# Altium schematic sheet JETSON AGX CSI-I2C-I2S.SchDoc: Jetson AGX CSI-I2C-I2S
size 431 x 279 mm; CheckedBy: Lance Bantoto; Engineer: Cindy Li, Chealsie Bains; DocumentNumber: 8; Revision: 1; SheetNumber: 8; SheetTotal: 23
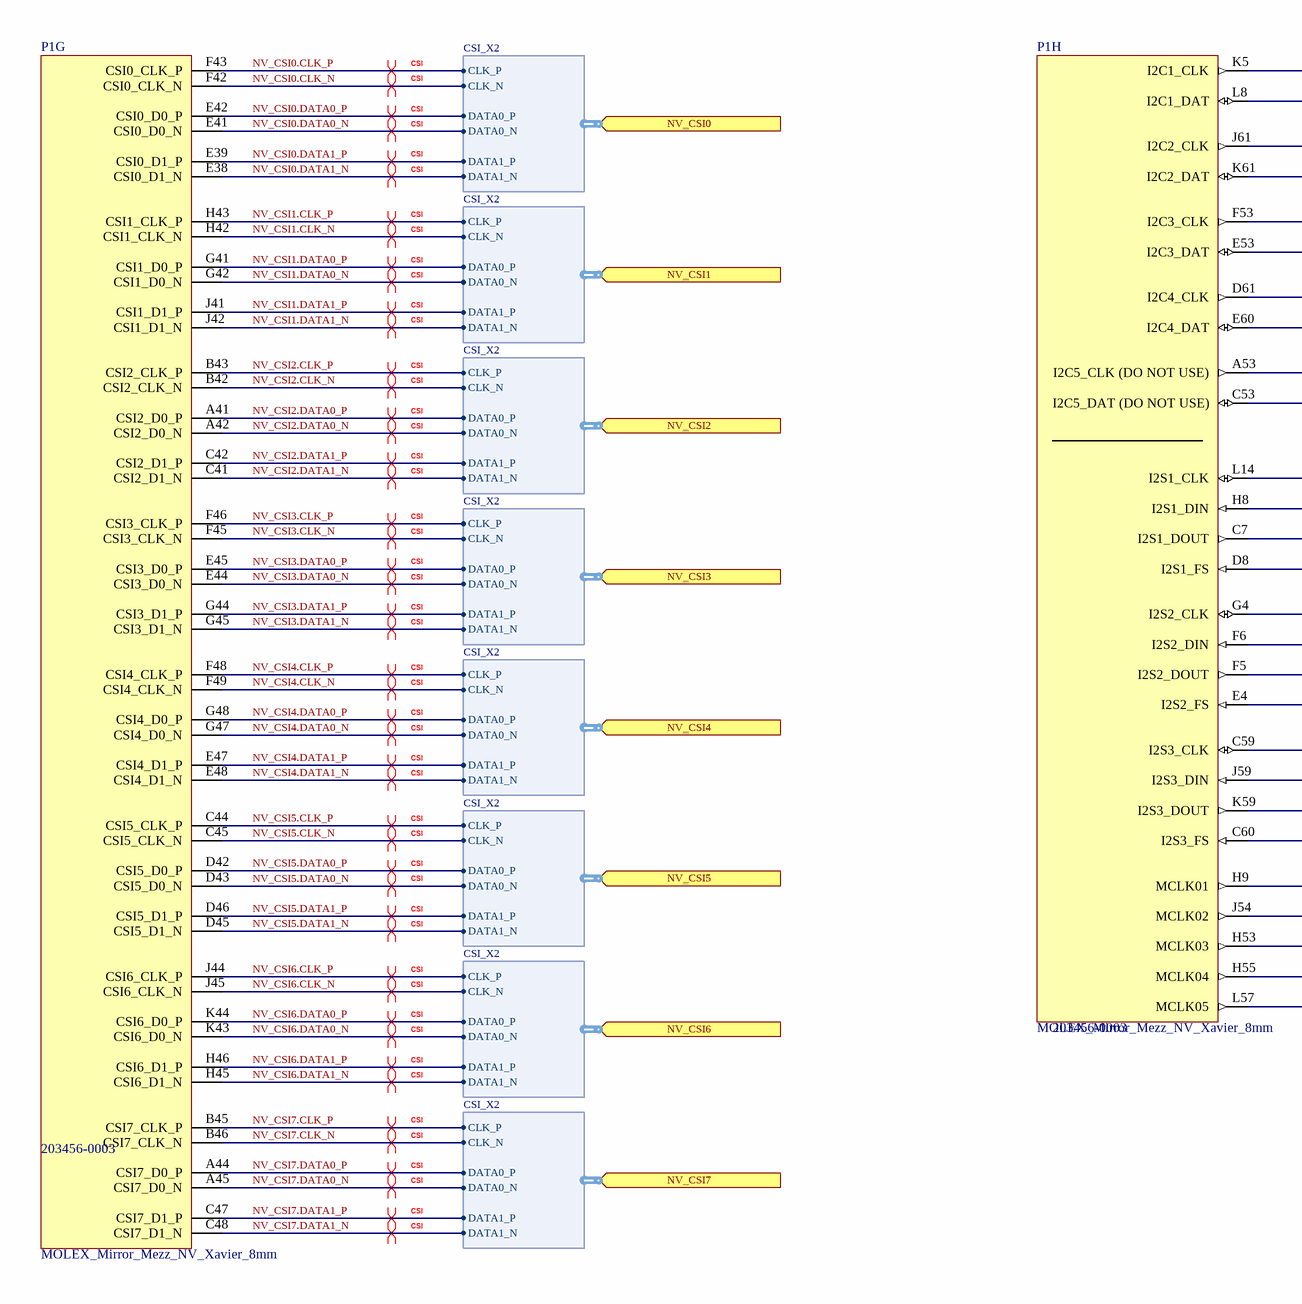
[diagram p0: JETSON AGX CSI-I2C-I2S.SchDoc, left]
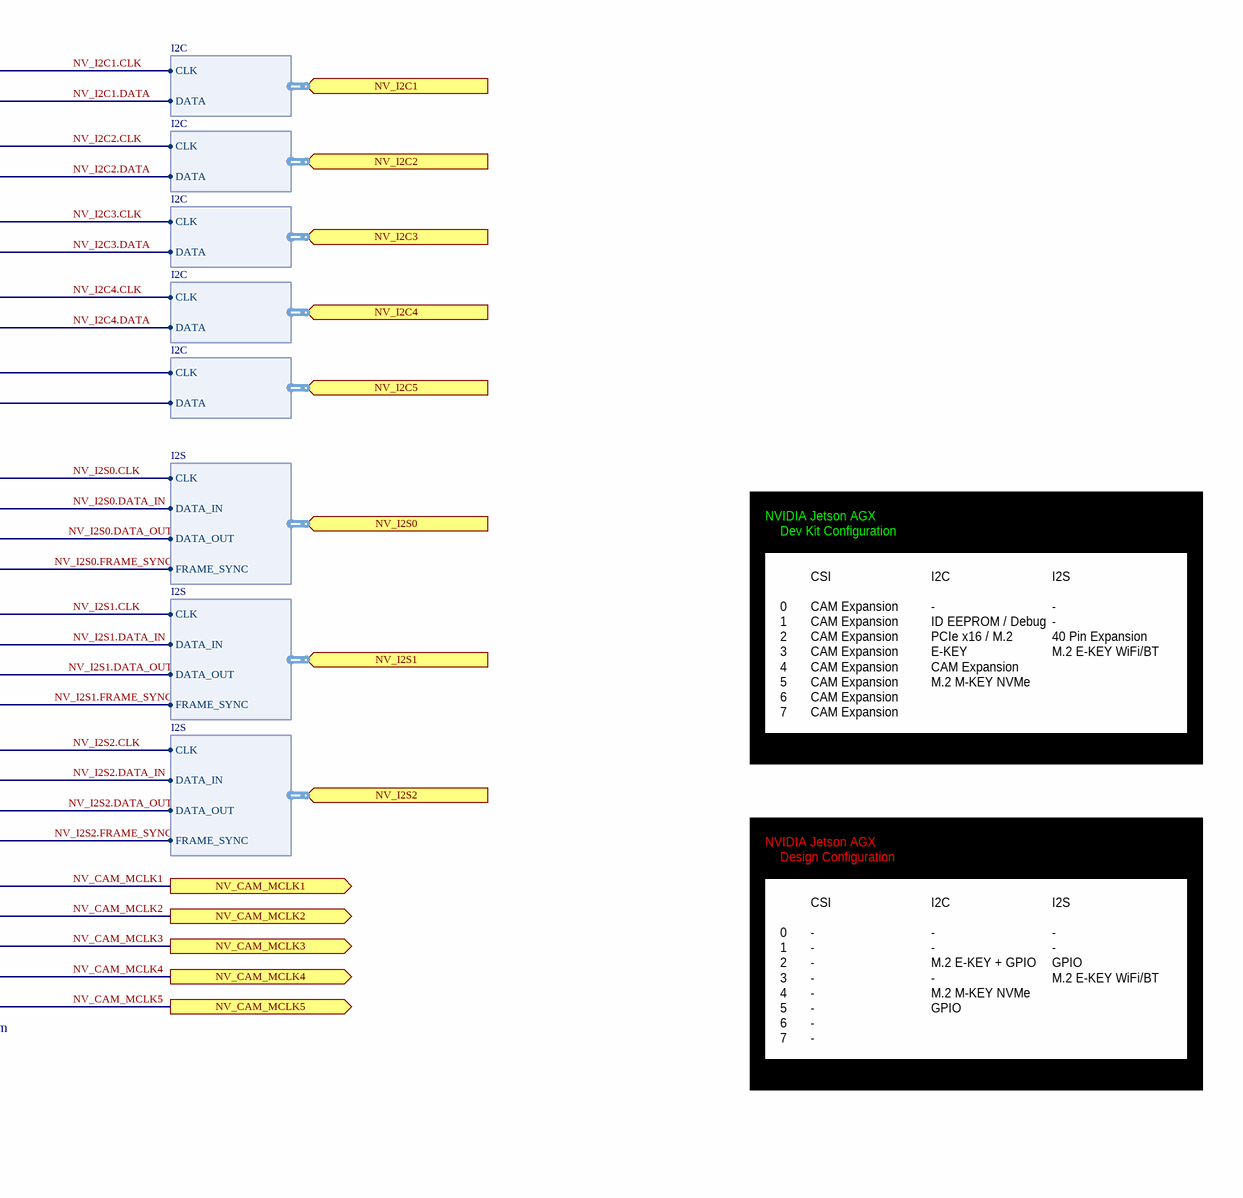
[diagram p1: JETSON AGX CSI-I2C-I2S.SchDoc, right]

## Parts
P1  MOLEX_Mirror_Mezz_NV_Xavier_8mm  [203456-0003]  (parts G,H of 15)

## Ports
NV_CAM_MCLK1 (out), NV_CAM_MCLK2 (out), NV_CAM_MCLK3 (out), NV_CAM_MCLK4 (out), NV_CAM_MCLK5 (out), NV_CSI0 (in, harness CSI_X2), NV_CSI1 (in, harness CSI_X2), NV_CSI2 (in, harness CSI_X2), NV_CSI3 (in, harness CSI_X2), NV_CSI4 (in, harness CSI_X2), NV_CSI5 (in, harness CSI_X2), NV_CSI6 (in, harness CSI_X2), NV_CSI7 (in, harness CSI_X2), NV_I2C1 (in, harness I2C), NV_I2C2 (in, harness I2C), NV_I2C3 (in, harness I2C), NV_I2C4 (in, harness I2C), NV_I2C5 (in, harness I2C), NV_I2S0 (in, harness I2S), NV_I2S1 (in, harness I2S), NV_I2S2 (in, harness I2S)

## Harnesses
CSI_X2: CLK_P, CLK_N, DATA0_P, DATA0_N, DATA1_P, DATA1_N
I2C: CLK, DATA
I2S: CLK, DATA_IN, DATA_OUT, FRAME_SYNC

## Nets
NV_CAM_MCLK1: P1.H9(MCLK01) ; port NV_CAM_MCLK1
NV_CAM_MCLK2: P1.J54(MCLK02) ; port NV_CAM_MCLK2
NV_CAM_MCLK3: P1.H53(MCLK03) ; port NV_CAM_MCLK3
NV_CAM_MCLK4: P1.H55(MCLK04) ; port NV_CAM_MCLK4
NV_CAM_MCLK5: P1.L57(MCLK05) ; port NV_CAM_MCLK5
NV_CSI0.CLK_N: P1.F42(CSI0_CLK_N) ; port NV_CSI0.CLK_N
NV_CSI0.CLK_P: P1.F43(CSI0_CLK_P) ; port NV_CSI0.CLK_P
NV_CSI0.DATA0_N: P1.E41(CSI0_D0_N) ; port NV_CSI0.DATA0_N
NV_CSI0.DATA0_P: P1.E42(CSI0_D0_P) ; port NV_CSI0.DATA0_P
NV_CSI0.DATA1_N: P1.E38(CSI0_D1_N) ; port NV_CSI0.DATA1_N
NV_CSI0.DATA1_P: P1.E39(CSI0_D1_P) ; port NV_CSI0.DATA1_P
NV_CSI1.CLK_N: P1.H42(CSI1_CLK_N) ; port NV_CSI1.CLK_N
NV_CSI1.CLK_P: P1.H43(CSI1_CLK_P) ; port NV_CSI1.CLK_P
NV_CSI1.DATA0_N: P1.G42(CSI1_D0_N) ; port NV_CSI1.DATA0_N
NV_CSI1.DATA0_P: P1.G41(CSI1_D0_P) ; port NV_CSI1.DATA0_P
NV_CSI1.DATA1_N: P1.J42(CSI1_D1_N) ; port NV_CSI1.DATA1_N
NV_CSI1.DATA1_P: P1.J41(CSI1_D1_P) ; port NV_CSI1.DATA1_P
NV_CSI2.CLK_N: P1.B42(CSI2_CLK_N) ; port NV_CSI2.CLK_N
NV_CSI2.CLK_P: P1.B43(CSI2_CLK_P) ; port NV_CSI2.CLK_P
NV_CSI2.DATA0_N: P1.A42(CSI2_D0_N) ; port NV_CSI2.DATA0_N
NV_CSI2.DATA0_P: P1.A41(CSI2_D0_P) ; port NV_CSI2.DATA0_P
NV_CSI2.DATA1_N: P1.C41(CSI2_D1_N) ; port NV_CSI2.DATA1_N
NV_CSI2.DATA1_P: P1.C42(CSI2_D1_P) ; port NV_CSI2.DATA1_P
NV_CSI3.CLK_N: P1.F45(CSI3_CLK_N) ; port NV_CSI3.CLK_N
NV_CSI3.CLK_P: P1.F46(CSI3_CLK_P) ; port NV_CSI3.CLK_P
NV_CSI3.DATA0_N: P1.E44(CSI3_D0_N) ; port NV_CSI3.DATA0_N
NV_CSI3.DATA0_P: P1.E45(CSI3_D0_P) ; port NV_CSI3.DATA0_P
NV_CSI3.DATA1_N: P1.G45(CSI3_D1_N) ; port NV_CSI3.DATA1_N
NV_CSI3.DATA1_P: P1.G44(CSI3_D1_P) ; port NV_CSI3.DATA1_P
NV_CSI4.CLK_N: P1.F49(CSI4_CLK_N) ; port NV_CSI4.CLK_N
NV_CSI4.CLK_P: P1.F48(CSI4_CLK_P) ; port NV_CSI4.CLK_P
NV_CSI4.DATA0_N: P1.G47(CSI4_D0_N) ; port NV_CSI4.DATA0_N
NV_CSI4.DATA0_P: P1.G48(CSI4_D0_P) ; port NV_CSI4.DATA0_P
NV_CSI4.DATA1_N: P1.E48(CSI4_D1_N) ; port NV_CSI4.DATA1_N
NV_CSI4.DATA1_P: P1.E47(CSI4_D1_P) ; port NV_CSI4.DATA1_P
NV_CSI5.CLK_N: P1.C45(CSI5_CLK_N) ; port NV_CSI5.CLK_N
NV_CSI5.CLK_P: P1.C44(CSI5_CLK_P) ; port NV_CSI5.CLK_P
NV_CSI5.DATA0_N: P1.D43(CSI5_D0_N) ; port NV_CSI5.DATA0_N
NV_CSI5.DATA0_P: P1.D42(CSI5_D0_P) ; port NV_CSI5.DATA0_P
NV_CSI5.DATA1_N: P1.D45(CSI5_D1_N) ; port NV_CSI5.DATA1_N
NV_CSI5.DATA1_P: P1.D46(CSI5_D1_P) ; port NV_CSI5.DATA1_P
NV_CSI6.CLK_N: P1.J45(CSI6_CLK_N) ; port NV_CSI6.CLK_N
NV_CSI6.CLK_P: P1.J44(CSI6_CLK_P) ; port NV_CSI6.CLK_P
NV_CSI6.DATA0_N: P1.K43(CSI6_D0_N) ; port NV_CSI6.DATA0_N
NV_CSI6.DATA0_P: P1.K44(CSI6_D0_P) ; port NV_CSI6.DATA0_P
NV_CSI6.DATA1_N: P1.H45(CSI6_D1_N) ; port NV_CSI6.DATA1_N
NV_CSI6.DATA1_P: P1.H46(CSI6_D1_P) ; port NV_CSI6.DATA1_P
NV_CSI7.CLK_N: P1.B46(CSI7_CLK_N) ; port NV_CSI7.CLK_N
NV_CSI7.CLK_P: P1.B45(CSI7_CLK_P) ; port NV_CSI7.CLK_P
NV_CSI7.DATA0_N: P1.A45(CSI7_D0_N) ; port NV_CSI7.DATA0_N
NV_CSI7.DATA0_P: P1.A44(CSI7_D0_P) ; port NV_CSI7.DATA0_P
NV_CSI7.DATA1_N: P1.C48(CSI7_D1_N) ; port NV_CSI7.DATA1_N
NV_CSI7.DATA1_P: P1.C47(CSI7_D1_P) ; port NV_CSI7.DATA1_P
NV_I2C1.CLK: P1.K5(I2C1_CLK) ; port NV_I2C1.CLK
NV_I2C1.DATA: P1.L8(I2C1_DAT) ; port NV_I2C1.DATA
NV_I2C2.CLK: P1.J61(I2C2_CLK) ; port NV_I2C2.CLK
NV_I2C2.DATA: P1.K61(I2C2_DAT) ; port NV_I2C2.DATA
NV_I2C3.CLK: P1.F53(I2C3_CLK) ; port NV_I2C3.CLK
NV_I2C3.DATA: P1.E53(I2C3_DAT) ; port NV_I2C3.DATA
NV_I2C4.CLK: P1.D61(I2C4_CLK) ; port NV_I2C4.CLK
NV_I2C4.DATA: P1.E60(I2C4_DAT) ; port NV_I2C4.DATA
NV_I2S0.CLK: P1.L14(I2S1_CLK) ; port NV_I2S0.CLK
NV_I2S0.DATA_IN: P1.H8(I2S1_DIN) ; port NV_I2S0.DATA_IN
NV_I2S0.DATA_OUT: P1.C7(I2S1_DOUT) ; port NV_I2S0.DATA_OUT
NV_I2S0.FRAME_SYNC: P1.D8(I2S1_FS) ; port NV_I2S0.FRAME_SYNC
NV_I2S1.CLK: P1.G4(I2S2_CLK) ; port NV_I2S1.CLK
NV_I2S1.DATA_IN: P1.F6(I2S2_DIN) ; port NV_I2S1.DATA_IN
NV_I2S1.DATA_OUT: P1.F5(I2S2_DOUT) ; port NV_I2S1.DATA_OUT
NV_I2S1.FRAME_SYNC: P1.E4(I2S2_FS) ; port NV_I2S1.FRAME_SYNC
NV_I2S2.CLK: P1.C59(I2S3_CLK) ; port NV_I2S2.CLK
NV_I2S2.DATA_IN: P1.J59(I2S3_DIN) ; port NV_I2S2.DATA_IN
NV_I2S2.DATA_OUT: P1.K59(I2S3_DOUT) ; port NV_I2S2.DATA_OUT
NV_I2S2.FRAME_SYNC: P1.C60(I2S3_FS) ; port NV_I2S2.FRAME_SYNC
NetP1_A53: P1.A53(I2C5_CLK_(DO_NOT_USE)) ; port NV_I2C5.CLK
NetP1_C53: P1.C53(I2C5_DAT_(DO_NOT_USE)) ; port NV_I2C5.DATA

## Layout directives
differential pair; differential pair class NV_CSI; differential pair class NV_CSI0; differential pair class CSI: NV_CSI0.CLK_N, NV_CSI0.CLK_P, NV_CSI0.DATA0_N, NV_CSI0.DATA0_P, NV_CSI0.DATA1_N, NV_CSI0.DATA1_P
differential pair; differential pair class NV_CSI; differential pair class NV_CSI1; differential pair class CSI: NV_CSI1.CLK_N, NV_CSI1.CLK_P, NV_CSI1.DATA0_N, NV_CSI1.DATA0_P, NV_CSI1.DATA1_N, NV_CSI1.DATA1_P
differential pair; differential pair class NV_CSI; differential pair class NV_CSI2; differential pair class CSI: NV_CSI2.CLK_N, NV_CSI2.CLK_P, NV_CSI2.DATA0_N, NV_CSI2.DATA0_P, NV_CSI2.DATA1_N, NV_CSI2.DATA1_P
differential pair; differential pair class NV_CSI; differential pair class NV_CSI3; differential pair class CSI: NV_CSI3.CLK_N, NV_CSI3.CLK_P, NV_CSI3.DATA0_N, NV_CSI3.DATA0_P, NV_CSI3.DATA1_N, NV_CSI3.DATA1_P
differential pair; differential pair class NV_CSI; differential pair class NV_CSI4; differential pair class CSI: NV_CSI4.CLK_N, NV_CSI4.CLK_P, NV_CSI4.DATA0_N, NV_CSI4.DATA0_P, NV_CSI4.DATA1_N, NV_CSI4.DATA1_P
differential pair; differential pair class NV_CSI; differential pair class NV_CSI5; differential pair class CSI: NV_CSI5.CLK_N, NV_CSI5.CLK_P, NV_CSI5.DATA0_N, NV_CSI5.DATA0_P, NV_CSI5.DATA1_N, NV_CSI5.DATA1_P
differential pair; differential pair class NV_CSI; differential pair class NV_CSI6; differential pair class CSI: NV_CSI6.CLK_N, NV_CSI6.CLK_P, NV_CSI6.DATA0_N, NV_CSI6.DATA0_P, NV_CSI6.DATA1_N, NV_CSI6.DATA1_P
differential pair; differential pair class NV_CSI; differential pair class NV_CSI7; differential pair class CSI: NV_CSI7.CLK_N, NV_CSI7.CLK_P, NV_CSI7.DATA0_N, NV_CSI7.DATA0_P, NV_CSI7.DATA1_N, NV_CSI7.DATA1_P

## Notes on the sheet
- NVIDIA Jetson AGX
- Dev Kit Configuration
- CSI
- I2C
- I2S
- -
  ID EEPROM / Debug
  PCIe x16 / M.2 E-KEY
  CAM Expansion
  M.2 M-KEY NVMe
  40 Pin Expansion
- -
  -
  40 Pin Expansion
  M.2 E-KEY WiFi/BT
- 0
  1
  2
  3
  4
  5
  6
  7
  8
  9
  10
  11
- CAM Expansion
  CAM Expansion
  CAM Expansion
  CAM Expansion
  CAM Expansion
  CAM Expansion
  CAM Expansion
  CAM Expansion
- Design Configuration
- -
  -
  GPIO
  M.2 E-KEY WiFi/BT
- -
  -
  -
  -
  -
  -
  -
  -
- -
  -
  M.2 E-KEY + GPIO
  -
  M.2 M-KEY NVMe
  GPIO
- University of Waterloo Robotics Team
- 200 University Ave W
- REV
- PROJECT
- Waterloo, Ontario, Canada
- N2L 3G1
- DOCUMENT
- ENGINEER
- REVIEWER
- MODIFIED
- SHEET
- OF

## Library data of the parts
P1 = MOLEX_Mirror_Mezz_NV_Xavier_8mm: CONN SELF-MATE 699POS SMD GOLD; Manufacturer 1: Molex; Supplier 1: Digi-Key; Supplier Part Number 1: WM25528CT-ND; Manufacturer Part Number 1: 203456-0003